# EAGLE design tiny_robot_rene_smd (EAGLE 6.1)
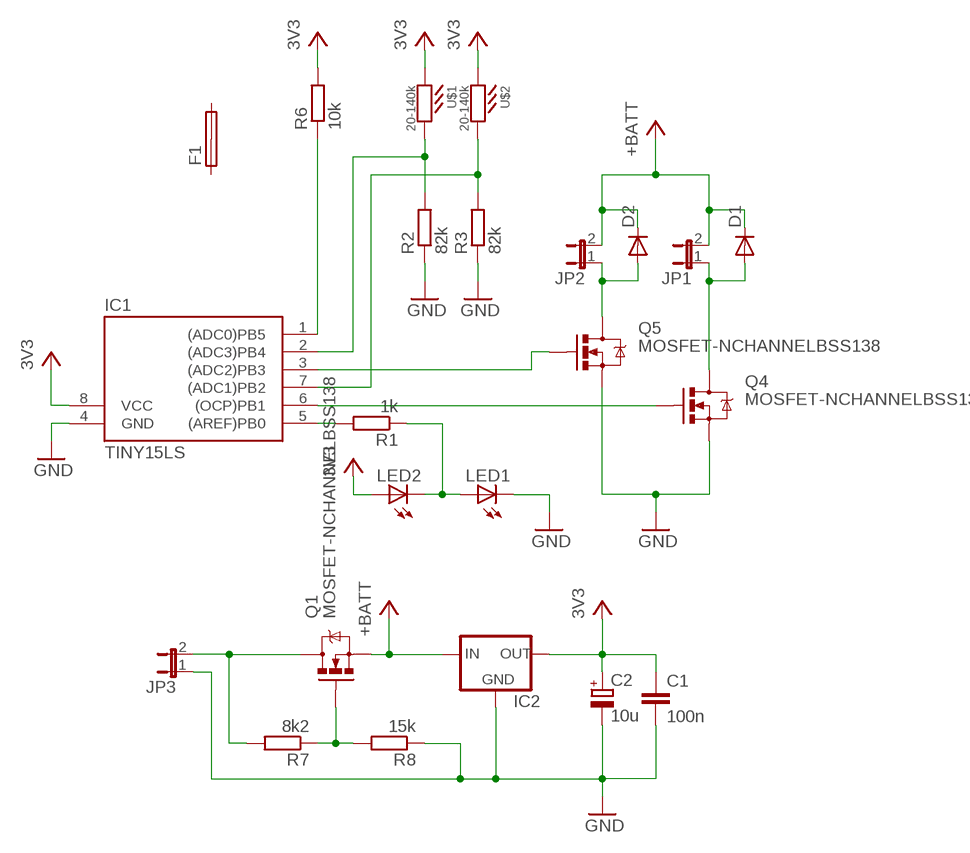
[diagram p0: schematic, sheet 1]

## Parts
C1  100n  C-EUC0805K  [C0805K]
C2  10u  CPOL-EUSANYO_SMD_A5  [SANYO-OSCON_SMD_A5]
D1  DIODE-MINIMELF  [MINIMELF]
D2  DIODE-MINIMELF  [MINIMELF]
F1  SHK20L  [SHK20L]
IC1  TINY15LS  [SOIC8]
IC2  MCP1700SMD  [SOT23]
JP1  JP1E  [JP1]
JP2  JP1E  [JP1]
JP3  JP1E  [JP1]
LED1  LEDCHIPLED_0805  [CHIPLED_0805]
LED2  LEDCHIPLED_0805  [CHIPLED_0805]
Q1  MOSFET-NCHANNELBSS138  [SOT23]
Q4  MOSFET-NCHANNELBSS138  [SOT23]
Q5  MOSFET-NCHANNELBSS138  [SOT23]
R1  1k  R-EU_M1206  [M1206]
R2  82k  R-EU_M1206  [M1206]
R3  82k  R-EU_M1206  [M1206]
R6  10k  R-EU_M1206  [M1206]
R7  8k2  R-EU_M0805  [M0805]
R8  15k  R-EU_M0805  [M0805]
U$1  20-140k  LDR-906014  [LDR-906014]
U$2  20-140k  LDR-906014  [LDR-906014]

## Nets
+5V: D1.C D2.C IC2.3(IN) JP1.2 JP2.2 Q1.2(S) ; supply symbol labelled +BATT
GND: C1.2 C2.- IC1.4(GND) IC2.1(GND) JP3.1 LED1.C Q4.2(S) Q5.2(S) R2.1 R3.1 R8.1
N$1: JP3.2 Q1.3(D) R7.2
N$2: IC1.5((AREF)PB0) R1.2
N$3: IC1.6((OCP)PB1) Q4.1(G)
N$4: LED1.A LED2.C R1.1
N$5: Q1.1(G) R7.1 R8.2
N$6: IC1.3((ADC2)PB3) Q5.1(G)
N$11: D2.A JP2.1 Q5.3(D)
N$12: D1.A JP1.1 Q4.3(D)
N$13: IC1.7((ADC1)PB2) R3.2 U$2.P$2
N$15: IC1.2((ADC3)PB4) R2.2 U$1.P$2
RST: IC1.1((ADC0)PB5) R6.1
VCC: C1.1 C2.+ IC1.8(VCC) IC2.2(OUT) LED2.A R6.2 U$1.P$1 U$2.P$1 ; supply symbol labelled 3V3
Unconnected: F1.1A F1.1B F1.2A F1.2B

## Library data of the parts
C1 = rcl:C-EU: CAPACITOR, European symbol
C2 = rcl:CPOL-EU: POLARIZED CAPACITOR, European symbol
D1 D2 = diode:DIODE-: DIODE
F1 = fuse:SHK20L: FUSE HOLDER 5 x 20 mm, SH contact, SHH1 Schukat, E1073 Buerklin
IC1 = atmel:TINY15L: MICROCONTROLLER 2.7 V 1 Kbytes FLASH 64 bytes EEPROM 4-channel 10 bit ADC
IC2 = _MY_OWN_LIB:MCP1700: VOLTAGE REGULATOR
JP1-JP3 = jumper:JP1E: JUMPER
LED1 LED2 = led:LED: LED OSRAM: - CHIPLED LG R971, LG N971, LY N971, LG Q971, LY Q971, LO R971, LY R971 LH N974, LH R974 LS Q976, LO Q976, LY Q976 LO Q996 - Hyper CHIPLED LW Q18S LB Q993, LB Q99A, LB R99A - SideLED LS A670, LO A670, LY A670, LG A670, LP A670 LB A673, LV A673, LT A673, LW A673 LH A674 LY A675 LS A676, LA A676, LO A676, LY A676, LW A676 LS A679, LY A679, LG A679 - Hyper Micro SIDELED® LS Y876, LA Y876, LO Y876, LY Y876 LT Y87S - SmartLED LW L88C, LW L88S LB L89C, LB L89S, LG L890 LS L89K, LO L89K, LY L89K LS L896, LA L896, LO L896, LY L896 - TOPLED LS T670, LO T670, LY T670, LG T670, LP T670 LSG T670, LSP T670, LSY T670, LOP T670, LYG T670 LG T671, LOG T671, LSG T671 LB T673, LV T673, LT T673, LW T673 LH T674 LS T676, LA T676, LO T676, LY T676, LB T676, LH T676, LSB T676, LW T676 LB T67C, LV T67C, LT T67C, LS T67K, LO T67K, LY T67K, LW E67C LS E67B, LA E67B, LO E67B, LY E67B, LB E67C, LV E67C, LT E67C LW T67C LS T679, LY T679, LG T679 LS T770, LO T770, LY T770, LG T770, LP T770 LB T773, LV T773, LT T773, LW T773 LH T774 LS E675, LA E675, LY E675, LS T675 LS T776, LA T776, LO T776, LY T776, LB T776 LHGB T686 LT T68C, LB T68C - Hyper Mini TOPLED® LB M676 - Mini TOPLED Santana® LG M470 LS M47K, LO M47K, LY M47K Source: http://www.osram.convergy.de LUXEON: - LUMILED® LXK2-PW12-R00, LXK2-PW12-S00, LXK2-PW14-U00, LXK2-PW14-V00 LXK2-PM12-R00, LXK2-PM12-S00, LXK2-PM14-U00 LXK2-PE12-Q00, LXK2-PE12-R00, LXK2-PE12-S00, LXK2-PE14-T00, LXK2-PE14-U00 LXK2-PB12-K00, LXK2-PB12-L00, LXK2-PB12-M00, LXK2-PB14-N00, LXK2-PB14-P00, LXK2-PB14-Q00 LXK2-PR12-L00, LXK2-PR12-M00, LXK2-PR14-Q00, LXK2-PR14-R00 LXK2-PD12-Q00, LXK2-PD12-R00, LXK2-PD12-S00 LXK2-PH12-R00, LXK2-PH12-S00 LXK2-PL12-P00, LXK2-PL12-Q00, LXK2-PL12-R00 Source: www.luxeon.com KINGBRIGHT: KA-3528ASYC Source: www.kingbright.com
Q1 Q4 Q5 = SparkFun-DiscreteSemi:MOSFET-NCHANNEL: Common NMOSFET Parts MFG P/N Store ID Prod ID FDD8780 TRANS-09984 SI7820DN TRANS-11055 FDS6630A IC-08089 2N7002PW TRANS-11151 FQP30N06L COM-10213 TRANS-10060 BSS123LT1G TRANS-08345 BSS138 TRANS-00830 BS170 2N7000; PROD_ID: TRANS-00830
R1-R3 R6-R8 = rcl:R-EU_: RESISTOR, European symbol
U$1 U$2 = alex:LDR-906014

## Board
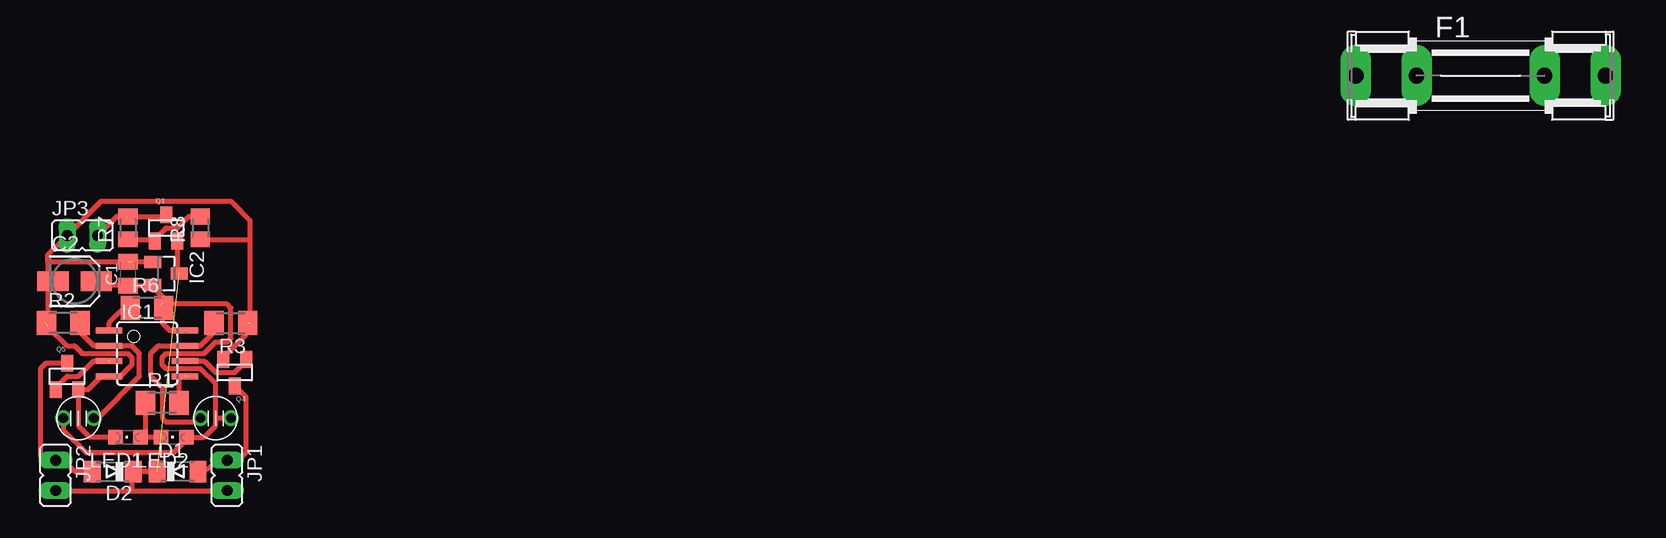
[diagram p1: board, top side]

No outline drawn. Coordinates in mm, seen from the top.
Copper layers (1*16): Top 0.035mm / dielectric 1.5mm / Bottom 0.035mm
Design rules: minimum track width 10mil, minimum drill 24mil, track to track 8mil, track to pad 8mil, pad to pad 8mil, via to via 8mil, smd to smd 8mil, copper to edge 40mil, drill to drill 8mil, minimum pad ring 10mil, minimum via ring 8mil, stop-mask expansion 4mil, vias tented up to drill 0mil, thermal gap 10mil

### Footprints (pad centres in the part's own frame; a part is rotated, then mirrored left to right if it is on the bottom)
C0805K = smd 1.3 x 1.6: 1 -1,0; 2 1,0
SANYO-OSCON_SMD_A5 = smd 2.6 x 1.6: + 1.8,0; - -1.8,0
MINIMELF = smd 1.4 x 1.8: A 1.7,0; C -1.7,0
SHK20L = drill 1.321 pad 2.54 long: 1A -10.414,0; 1B -5.334,0; 2A 10.414,0; 2B 5.334,0
SOIC8 = smd 0.5 x 2.2: 1 -1.905,-3.154; 2 -0.645,-3.154; 3 0.625,-3.154; 4 1.895,-3.154; 5 1.905,3.154; 6 0.635,3.154; 7 -0.635,3.154; 8 -1.905,3.154
SOT23 = smd 1 x 1.4: 1 -0.95,-1.1; 2 0.95,-1.1; 3 0,1.1
JP1 = drill 0.914 long: 1 0,-1.27; 2 0,1.27
CHIPLED_0805 = smd 1.2 x 1.2: A 0,-1.05; C 0,1.05
M1206 = smd 1.6 x 2: 1 -1.4,0; 2 1.4,0
M0805 = smd 1.3 x 1.6: 1 -0.95,0; 2 0.95,0
LDR-906014 = drill 0.8 pad 1.27: P$1 0,1.27; P$2 0,-1.27

### Placement (x,y rotation side)
C1  -32.7,36.83 90 top
C2  -37.15,36.2 0 top
D1  -28.57,20.32 0 top
D2  -33.97,20.32 180 top
F1  80.01,53.34 0 top
IC1  -31.11,30.16 270 top
IC2  -29.53,36.83 270 top
JP1  -24.45,20 180 top
JP2  -38.73,20 180 top
JP3  -36.51,40.01 270 top
LED1  -32.7,23.18 90 top
LED2  -28.89,23.18 90 top
Q1  -29.53,40.64 0 top
Q4  -23.81,28.57 180 top
Q5  -37.78,28.26 0 top
R1  -29.84,26.04 0 top
R2  -38.1,32.7 0 top
R3  -24.13,32.7 180 top
R6  -31.11,33.97 0 top
R7  -32.7,40.64 90 top
R8  -26.67,40.64 90 top
U$1  -36.83,24.77 90 top
U$2  -25.4,24.77 270 top

### Tracks (layer width: path | path; a pad name or v marks a point on that pad's centre or on a via)
+5V  (1 unrouted)
  Top 0.406: D2.C D1.C -32.38,20.32 -32.38,18.73 | JP2.2 -32.38,18.73 | -32.38,18.73 JP1.2 | Q1.2 -28.58,36.98 IC2.3
GND  (3 unrouted)
  Top 0.406: -38.55,36.59 C2.- -39.37,36.2 | -32.38,37.78 -39.37,37.78 | -34.28,28.26 -34.92,28.26 -36.02,27.16 Q5.2 | -34.28,28.26 IC1.4 | Q5.2 -36.83,24.13 -35.88,23.18 LED1.C | Q4.2 -24.76,29.85 -22.86,31.75 -22.86,32.57 R3.1 | -39.37,36.2 -39.37,32.38 -37.78,30.8 -37.15,30.8 -36.51,30.16 -32.7,30.16 -32.38,29.84 -32.38,29.21 -33.34,28.26 -34.28,28.26 | Q5.2 -36.83,27.3 | C1.2 -31,37.83 IC2.1 | -39.37,37.78 -39.37,36.2 | -22.54,39.69 -22.54,41.27 -24.13,42.86 -34.92,42.86 JP3.1 -39.37,38.42 -39.37,37.78 | -22.54,39.69 -22.54,32.7 | R8.1 -22.55,39.69 -22.54,39.69
N$1  (1 unrouted)
  Top 0.406: JP3.2 -33.66,41.59 R7.2 | R7.2 -29.68,41.59 Q1.3
N$2  (1 unrouted)
  Top 0.406: R1.2 -28.45,28.07 -28.26,28.26 -27.94,28.26
N$3  (1 unrouted)
  Top 0.406: IC1.6 -26.35,29.53 -25.4,28.57 -23.81,28.57 -22.86,29.53
N$4
  Top 0.406: LED2.C -31.11,23.18 | -31.11,23.18 LED1.A | R1.1 -31.25,22.99 -31.11,23.18
N$5
  Top 0.406: R7.1 -30.63,39.69 Q1.1 -30.48,39.69 -29.53,40.64 -28.57,40.64 -27.62,41.59 R8.2
N$6  (1 unrouted)
  Top 0.406: Q5.1 -38.73,27.31 -37.78,28.26 -36.83,28.26 -35.56,29.53 -34.29,29.53
N$11
  Top 0.406: Q5.3 -39.54,29.36 -40.01,28.89 -40.01,21.59 -39.69,21.27 JP2.1 -38.1,21.27 -37.15,20.32 D2.A
N$12
  Top 0.406: Q4.3 -22.86,26.52 -22.86,21.91 -23.5,21.27 JP1.1 -25.08,21.27 -26.35,20.32 D1.A
N$13
  Top 0.406: IC1.7 -27.94,30.8 | IC1.7 -26.67,30.8 -25.72,31.75 -25.72,32.52 R3.2 | IC1.7 -30.16,30.8 -30.8,30.16 -30.8,28.26 -29.84,27.3 -29.84,24.77 -29.53,24.45 -26.99,24.45 U$2.P$2
N$15
  Top 0.406: U$1.P$2 -35.24,24.77 -31.75,28.26 -31.75,30.16 -32.38,30.8 -33.02,30.8 -33.03,30.81 IC1.2 -35.57,30.81 -36.51,31.75 -36.51,32.52 R2.2
RST
  Top 0.406: R6.1 -32.52,34.48 -34.29,32.7 -34.29,32.09 IC1.1
VCC  (2 unrouted)
  Top 0.406: U$1.P$1 -38.1,23.81 -36.2,21.91 -28.89,21.91 -27.94,22.86 -27.94,22.76 LED2.A -26.35,23.18 -25.4,24.13 -25.4,24.77 | U$2.P$1 -25.4,24.77 | -25.4,24.77 -25.4,27.62 -26.67,28.89 -29.53,28.89 -29.84,29.21 -29.84,29.84 -29.53,30.16 -26.35,30.16 -25.4,31.11 -24.45,31.11 -24.13,31.43 -24.13,33.97 -24.45,34.29 -29.84,34.29 | -27.94,32.07 -29.21,32.07 -29.84,32.7 -29.84,34.29 | C2.+ -34.61,36.2 -34.29,35.88 -32.43,35.88 C1.1 -31,35.83 IC2.2 -30.8,35.88 -29.84,34.92 -29.84,34.29 | -29.99,34.25 R6.2